# EasyEDA schematic SCH_single-layer-routed_2024-06-21.json
TITLE: Sheet_1; REV: 1.0; Date: 2024-04-02; Sheet: 1/1; Drawn By: shishirnsu44; Company: Your Company
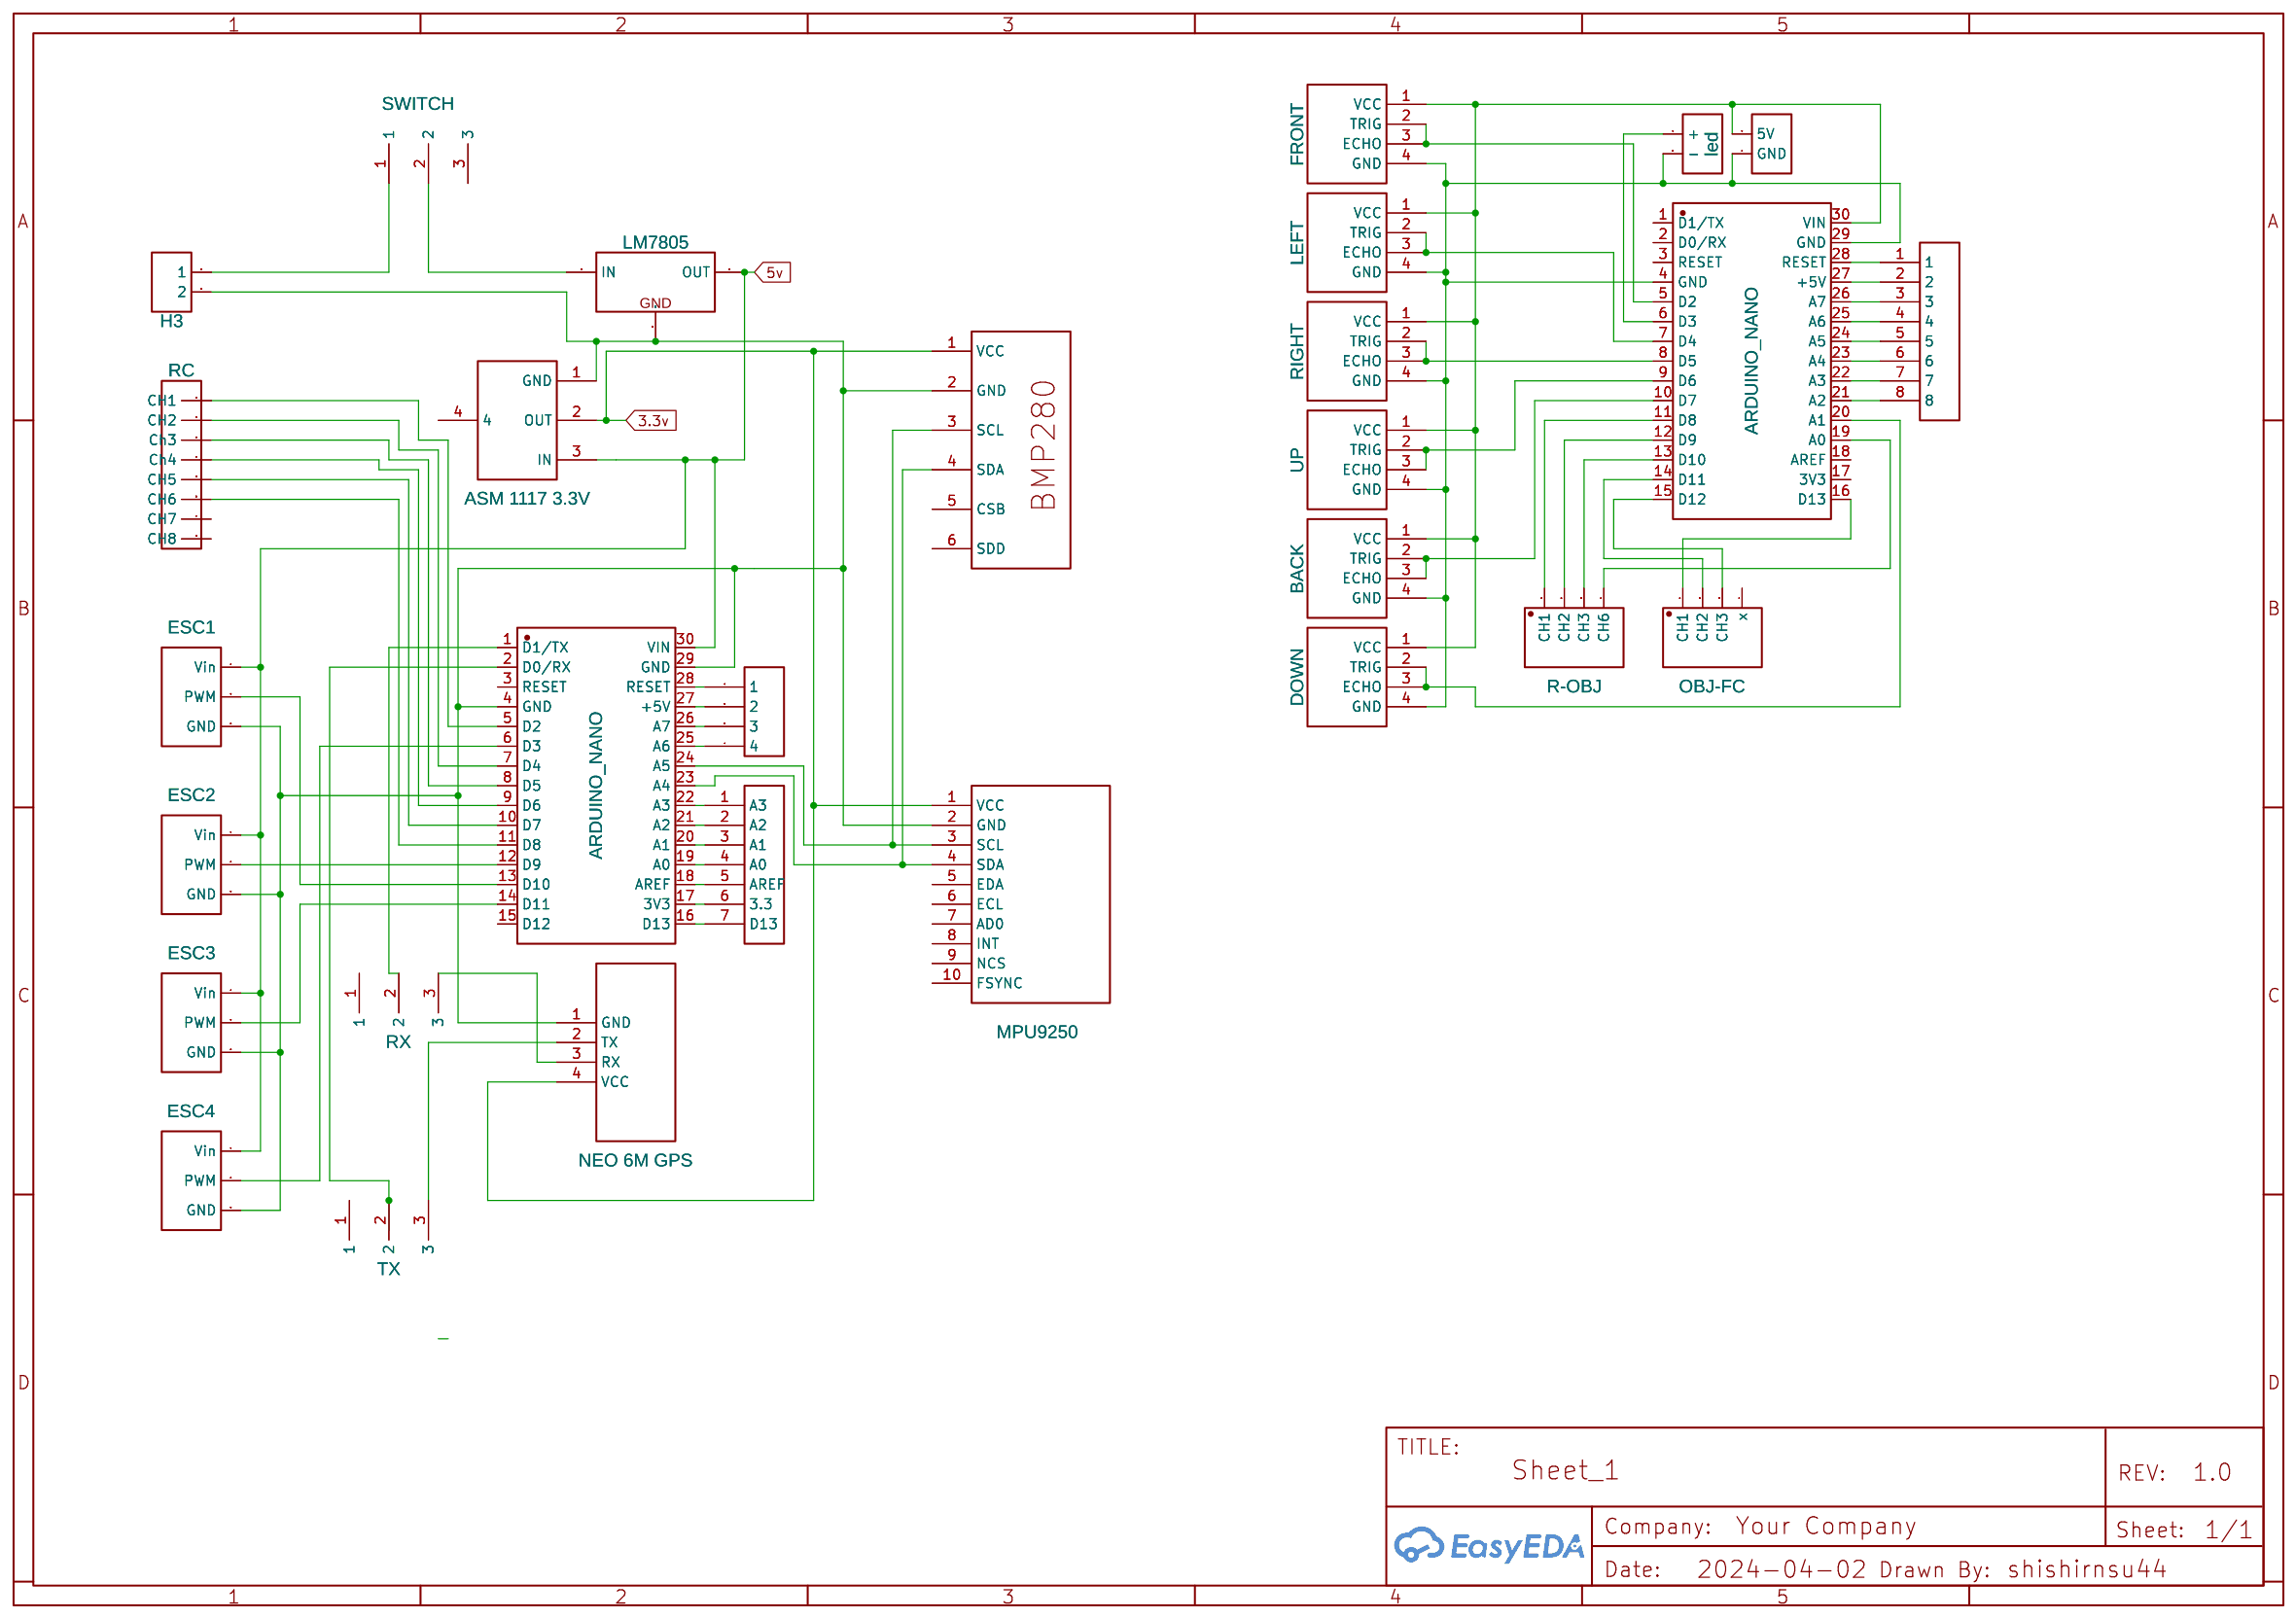
[diagram p0: schematic sheet]

## Parts
BACK  BORNERA SENSOR ULTRASONICO HC-SR04  [BORNERA SENSOR ULTRASONICO HC-SR04]
DOWN  Down  [BORNERA SENSOR ULTRASONICO HC-SR04]
ESC1  ESC  [CONNECTOR_PINHEADER_2.54MM:PINHEADER_1X3]
ESC2  ESC  [CONNECTOR_PINHEADER_2.54MM:PINHEADER_1X3]
ESC3  ESC  [CONNECTOR_PINHEADER_2.54MM:PINHEADER_1X3]
ESC4  ESC  [CONNECTOR_PINHEADER_2.54MM:PINHEADER_1X3]
FRONT  Front  [BORNERA SENSOR ULTRASONICO HC-SR04]
H1  1x2_Male_Pin_Header  [1X2/2.54_MALE_PIN_HEADER]
H2  led  [1X2/2.54_MALE_PIN_HEADER]
H3  1x2_Male_Pin_Header  [1X2/2.54_MALE_PIN_HEADER]
LEFT  Left  [BORNERA SENSOR ULTRASONICO HC-SR04]
MODULE2  NEO 6M GPS  [UBLOX NEO 6M GPS MODULE]
OBJ-FC  Header-Male-2.54_1x4  [HDR-TH_4P-P2.54-V-M]
P2  HEADER4x1  [HEADER4X1]
R-OBJ  Header-Male-2.54_1x4  [HDR-TH_4P-P2.54-V-M]
RC  pinheader08x1  [PINHEADER_08X1]
RIGHT  Rignt  [BORNERA SENSOR ULTRASONICO HC-SR04]
RX  SlideSwitch  [SLIDESWITCH]
SWITCH  SlideSwitch  [SLIDESWITCH]
TX  SlideSwitch  [SLIDESWITCH]
U1  ARDUINO_NANO  [COMM-TH_ARDUINO_NANO]
U2  BMP280 Pressure/Temp/Altitudesensor  [BMP280_]
U3  MPU9250  [GY9250(MPU9250)]
U4  LM7805  [LM7805]
U5  ASM 1117 3.3V  [ASM1117 5V]
U6  ARDUINO_NANO  [COMM-TH_ARDUINO_NANO]
U7  header8x1  [HEADER8X1]
U9  header7X1  [HEADER7X1]
UP  BORNERA SENSOR ULTRASONICO HC-SR04  [BORNERA SENSOR ULTRASONICO HC-SR04]

## Library data of the parts
BACK DOWN FRONT LEFT RIGHT UP = BORNERA SENSOR ULTRASONICO HC-SR04: Contributor: sergio.alan
ESC1-ESC4 = ESC: Contributor: paschawa5
H1-H3 = 1x2_Male_Pin_Header: Manufacturer Part: 210S-1*8P L=11.6MMGold-plated black; Contributor: sloppyferrets
MODULE2 = UBLOX NEO 6M GPS MODULE NO-ANTENNA: Contributor: rizki.chandra.1905366
OBJ-FC R-OBJ = Header-Male-2.54_1x4: Contributor: LCSC; Supplier: LCSC; Manufacturer: Ckmtw(灿科盟); Manufacturer Part: B-2100S04P-A110; Supplier Part: C124378; JLCPCB Part Class: Extended Part
P2 = HEADER4x1: Manufacturer Part: New SchematicLib; Contributor: an325
RC = pinheader08x1: Manufacturer Part: Header 6x1; Contributor: s1atbewie.de; Package Display: No
RX SWITCH TX = SlideSwitch: Contributor: feedcheque
U1 U6 = ARDUINO_NANO: Contributor: lcsc; Supplier: LCSC; Supplier Part: C9900017879; Manufacturer: null; JLCPCB Part Class: Extended Part
U2 = BMP280 Pressure/Temp/Altitudesensor: Contributor: MrSmilling
U3 = GY9250(MPU9250): Contributor: velavan.aero
U4 = LM7805: Manufacturer: TF; Supplier: LCSC; Supplier Part: C845394; Contributor: Jerhyn York
U5 = ASM 1117 5.0V: Contributor: Lajos Jóczik; ASM 1117 5.0V: 5.0
U7 = header8x1: Contributor: elfred
U9 = header7X1: Contributor: lgw3897

## Nets
3.3v: MODULE2.4(VCC) U2.1(VCC) U3.1(VCC) U5.2(OUT)
5v: ESC1.1(Vin) ESC2.1(Vin) ESC3.1(Vin) ESC4.1(Vin) U1.30(VIN) U4.3(OUT) U5.3(IN)
Net-(BACK-1): BACK.1(VCC) DOWN.1(VCC) FRONT.1(VCC) H1.2(5V) LEFT.1(VCC) RIGHT.1(VCC) U6.30(VIN) UP.1(VCC)
Net-(BACK-2): BACK.2(TRIG) BACK.3(ECHO) U6.10(D7)
Net-(BACK-4): BACK.4(GND) DOWN.4(GND) FRONT.4(GND) H1.1(GND) H2.2(-) LEFT.4(GND) RIGHT.4(GND) U6.4(GND) U6.29(GND) UP.4(GND)
Net-(DOWN-2): DOWN.2(TRIG) DOWN.3(ECHO) U6.20(A1)
Net-(ESC1-2): ESC1.2(PWM) U1.13(D10)
Net-(ESC1-3): ESC1.3(GND) ESC2.3(GND) ESC3.3(GND) ESC4.3(GND) H3.2 MODULE2.1(GND) U1.4(GND) U1.29(GND) U2.2(GND) U3.2(GND) U4.2(GND) U5.1(GND)
Net-(ESC2-2): ESC2.2(PWM) U1.12(D9)
Net-(ESC3-2): ESC3.2(PWM) U1.14(D11)
Net-(ESC4-2): ESC4.2(PWM) U1.6(D3)
Net-(FRONT-2): FRONT.2(TRIG) FRONT.3(ECHO) U6.5(D2)
Net-(H2-1): H2.1(+) U6.6(D3)
Net-(H3-1): H3.1 SWITCH.1
Net-(LEFT-2): LEFT.2(TRIG) LEFT.3(ECHO) U6.7(D4)
Net-(MODULE2-2): MODULE2.2(TX) TX.3
Net-(MODULE2-3): MODULE2.3(RX) RX.3
Net-(OBJ-FC-1): OBJ-FC.1(CH1) U6.16(D13)
Net-(OBJ-FC-2): OBJ-FC.2(CH2) U6.14(D11)
Net-(OBJ-FC-3): OBJ-FC.3(CH3) U6.15(D12)
Net-(P2-1): P2.1 U1.28(RESET)
Net-(P2-2): P2.2 U1.27(+5V)
Net-(P2-3): P2.3 U1.26(A7)
Net-(P2-4): P2.4 U1.25(A6)
Net-(R-OBJ-1): R-OBJ.1(CH1) U6.11(D8)
Net-(R-OBJ-2): R-OBJ.2(CH2) U6.12(D9)
Net-(R-OBJ-3): R-OBJ.3(CH3) U6.13(D10)
Net-(R-OBJ-4): R-OBJ.4(CH6) U6.19(A0)
Net-(RC-1): RC.1(CH1) U1.5(D2)
Net-(RC-2): RC.2(CH2) U1.7(D4)
Net-(RC-3): RC.3(Ch3) U1.8(D5)
Net-(RC-4): RC.4(Ch4) U1.9(D6)
Net-(RC-5): RC.5(CH5) U1.10(D7)
Net-(RC-6): RC.6(CH6) U1.11(D8)
Net-(RIGHT-2): RIGHT.2(TRIG) RIGHT.3(ECHO) U6.8(D5)
Net-(RX-2): RX.2 U1.1(D1/TX)
Net-(SWITCH-2): SWITCH.2 U4.1(IN)
Net-(TX-2): TX.2 U1.2(D0/RX)
Net-(U1-16): U1.16(D13) U9.7(D13)
Net-(U1-17): U1.17(3V3) U9.6(3.3)
Net-(U1-18): U1.18(AREF) U9.5(AREF)
Net-(U1-19): U1.19(A0) U9.4(A0)
Net-(U1-20): U1.20(A1) U9.3(A1)
Net-(U1-21): U1.21(A2) U9.2(A2)
Net-(U1-22): U1.22(A3) U9.1(A3)
Net-(U1-23): U1.23(A4) U2.4(SDA) U3.4(SDA)
Net-(U1-24): U1.24(A5) U2.3(SCL) U3.3(SCL)
Net-(U6-9): U6.9(D6) UP.2(TRIG) UP.3(ECHO)
Net-(U6-21): U6.21(A2) U7.8
Net-(U6-22): U6.22(A3) U7.7
Net-(U6-23): U6.23(A4) U7.6
Net-(U6-24): U6.24(A5) U7.5
Net-(U6-25): U6.25(A6) U7.4
Net-(U6-26): U6.26(A7) U7.3
Net-(U6-27): U6.27(+5V) U7.2
Net-(U6-28): U6.28(RESET) U7.1

Not connected (* = marked no-connect by the designer): OBJ-FC 4(x); RC 7(CH7) 8(CH8); RX 1; SWITCH 3; TX 1; U1 3(RESET) 15(D12); U2 5(CSB) 6(SDD); U3 5(EDA) 6(ECL) 7(AD0) 8(INT) 9(NCS) 10(FSYNC); U5 4; U6 1(D1/TX) 2(D0/RX) 3(RESET) 17(3V3) 18(AREF)
